# EAGLE design relocker_schematic_cleaned (EAGLE 9.1.3)
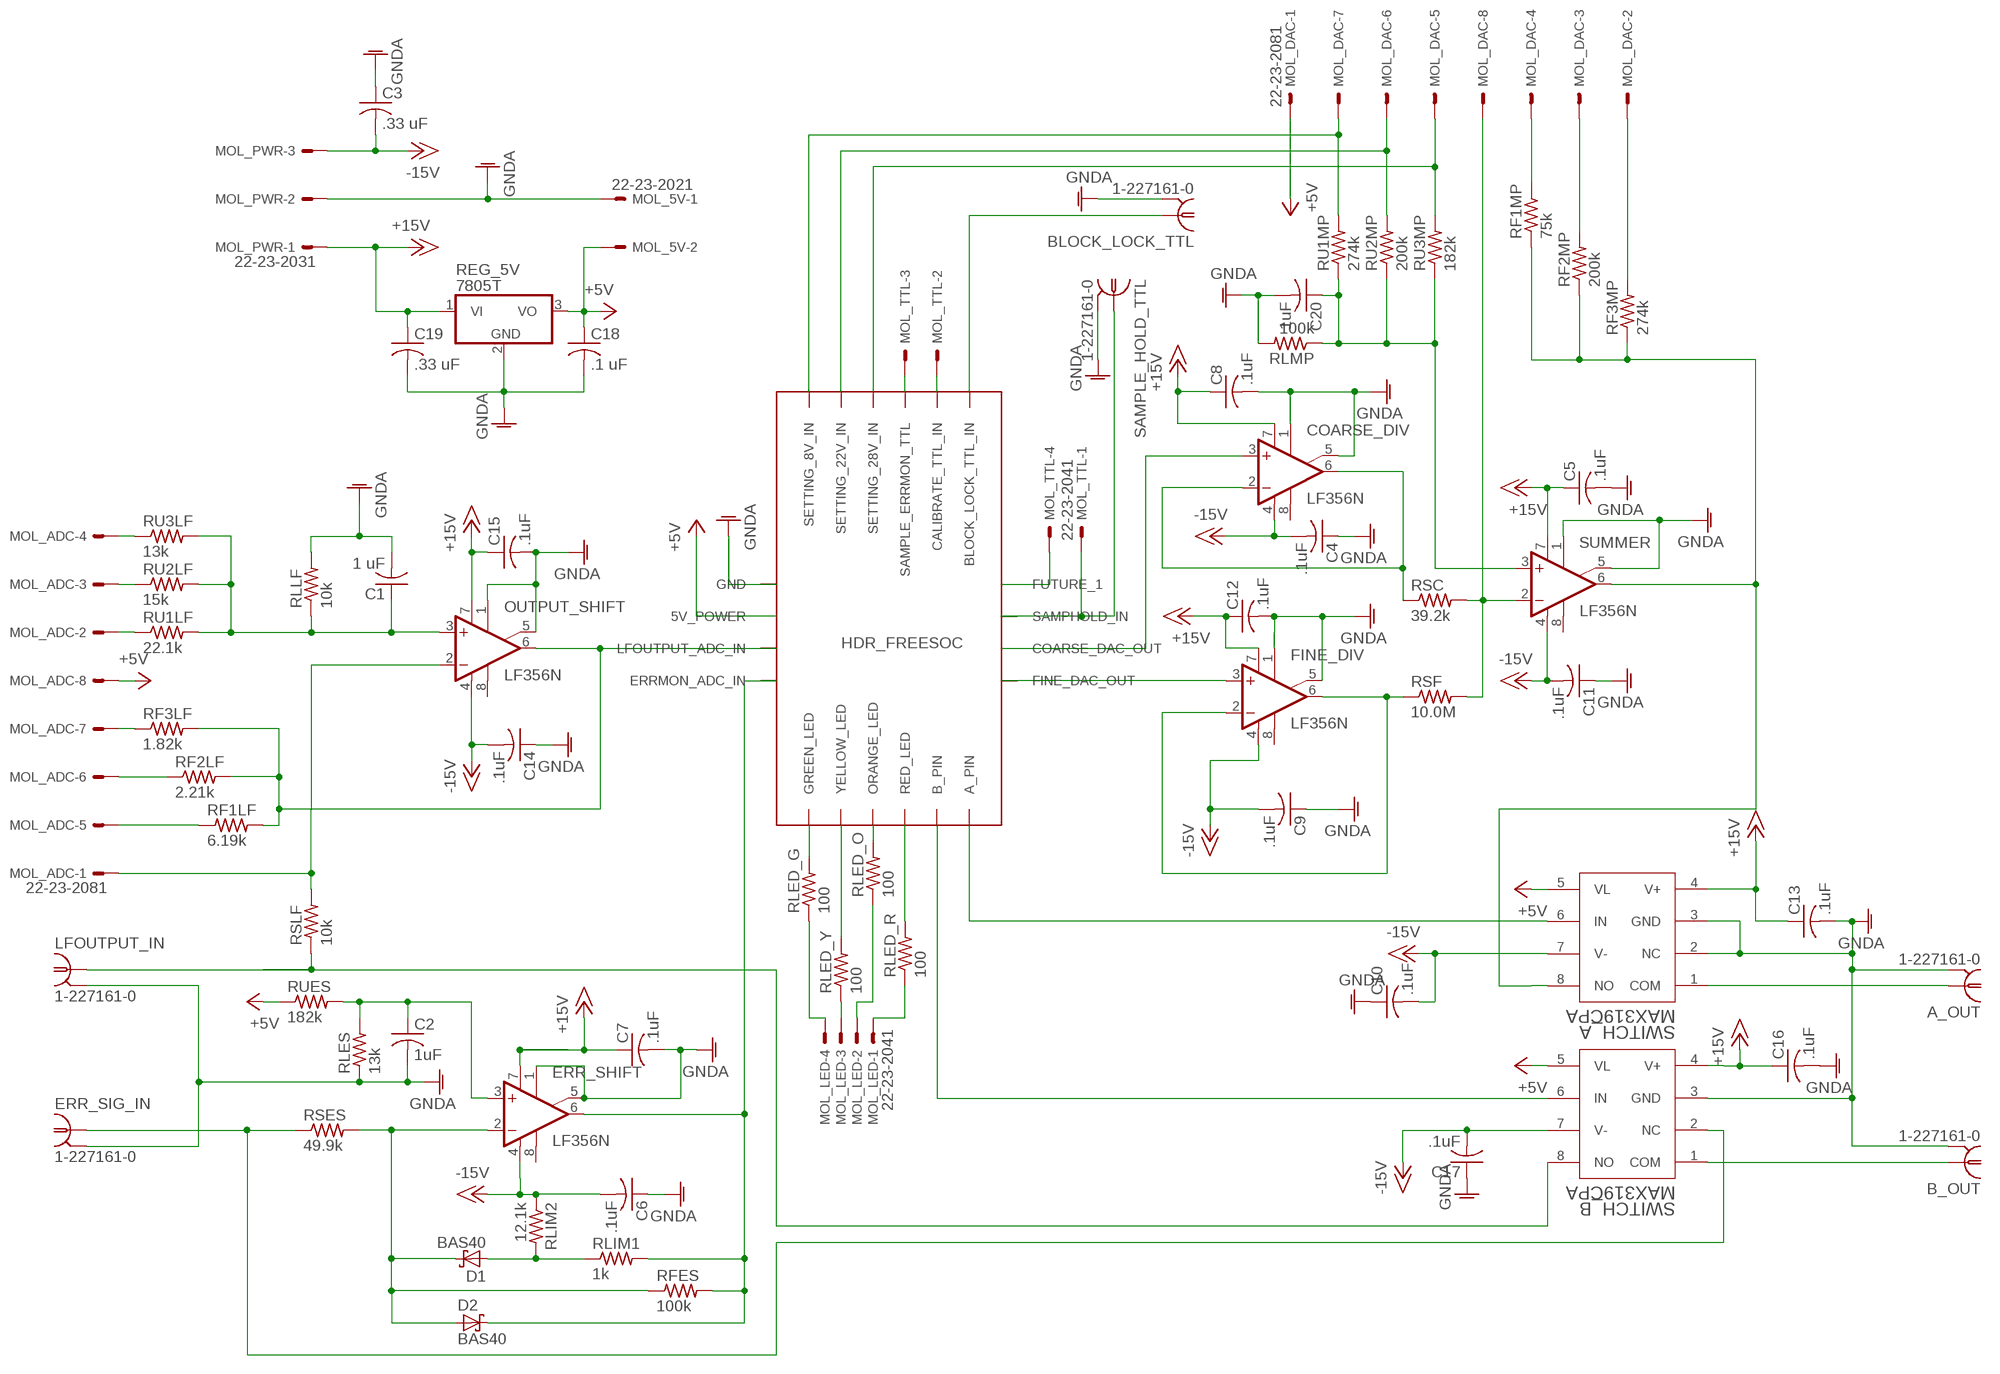
[diagram p0: schematic, sheet 1]

## Parts
A_OUT  1-227161-0  [AMP_227161]
B_OUT  1-227161-0  [AMP_227161]
BLOCK_LOCK_TTL  1-227161-0  [AMP_227161]
C1  1 uF  C-USC0805  [C0805]
C2  1uF  C-USC0805  [C0805]
C3  .33 uF  C-USC0805  [C0805]
C4  .1uF  C-USC0805  [C0805]
C5  .1uF  C-USC0805  [C0805]
C6  .1uF  C-USC0805  [C0805]
C7  .1uF  C-USC0805  [C0805]
C8  .1uF  C-USC0805  [C0805]
C9  .1uF  C-USC0805  [C0805]
C10  .1uF  C-USC0805  [C0805]
C11  .1uF  C-USC0805  [C0805]
C12  .1uF  C-USC0805  [C0805]
C13  .1uF  C-USC0805  [C0805]
C14  .1uF  C-USC0805  [C0805]
C15  .1uF  C-USC0805  [C0805]
C16  .1uF  C-USC0805  [C0805]
C17  .1uF  C-USC0805  [C0805]
C18  .1 uF  C-USC0805  [C0805]
C19  .33 uF  C-USC0805  [C0805]
C20  1uF  C-USC0805  [C0805]
COARSE_DIV  LF356N  [DIL08]
D1  BAS40  [SOT23]
D2  BAS40  [SOT23]
ERR_SHIFT  LF356N  [DIL08]
ERR_SIG_IN  1-227161-0  [AMP_227161]
FINE_DIV  LF356N  [DIL08]
HDR_FREESOC  FREESOC2_BREAKOUT  [FREESOC2_BREAKOUT]
LFOUTPUT_IN  1-227161-0  [AMP_227161]
MOL_5V  22-23-2021  [22-23-2021]
MOL_ADC  22-23-2081  [22-23-2081]
MOL_DAC  22-23-2081  [22-23-2081]
MOL_LED  22-23-2041  [22-23-2041]
MOL_PWR  22-23-2031  [22-23-2031]
MOL_TTL  22-23-2041  [22-23-2041]
OUTPUT_SHIFT  LF356N  [DIL08]
REG_5V  7805T  [TO220H]
RF1LF  6.19k  R-US_R0805  [R0805]
RF1MP  75k  R-US_R0805  [R0805]
RF2LF  2.21k  R-US_R0805  [R0805]
RF2MP  200k  R-US_R0805  [R0805]
RF3LF  1.82k  R-US_R0805  [R0805]
RF3MP  274k  R-US_R0805  [R0805]
RFES  100k  R-US_R0805  [R0805]
RLED_G  100  R-US_R0805  [R0805]
RLED_O  100  R-US_R0805  [R0805]
RLED_R  100  R-US_R0805  [R0805]
RLED_Y  100  R-US_R0805  [R0805]
RLES  13k  R-US_R0805  [R0805]
RLIM1  1k  R-US_R0805  [R0805]
RLIM2  12.1k  R-US_R0805  [R0805]
RLLF  10k  R-US_R0805  [R0805]
RLMP  100k  R-US_R0805  [R0805]
RSC  39.2k  R-US_R0805  [R0805]
RSES  49.9k  R-US_R0805  [R0805]
RSF  10.0M  R-US_R0805  [R0805]
RSLF  10k  R-US_R0805  [R0805]
RU1LF  22.1k  R-US_R0805  [R0805]
RU1MP  274k  R-US_R0805  [R0805]
RU2LF  15k  R-US_R0805  [R0805]
RU2MP  200k  R-US_R0805  [R0805]
RU3LF  13k  R-US_R0805  [R0805]
RU3MP  182k  R-US_R0805  [R0805]
RUES  182k  R-US_R0805  [R0805]
SAMPLE_HOLD_TTL  1-227161-0  [AMP_227161]
SUMMER  LF356N  [DIL08]
SWITCH_A  MAX319CPA  [21-0043D_8]
SWITCH_B  MAX319CPA  [21-0043D_8]

## Nets
+5V: C18.1 HDR_FREESOC.1(5V_POWER) MOL_5V.2 MOL_ADC.8 MOL_DAC.1 REG_5V.3(VO) RUES.1 SWITCH_A.5(VL) SWITCH_B.5(VL)
+15V: C5.1 C7.1 C8.1 C12.1 C13.1 C15.1 C16.1 C19.1 COARSE_DIV.7(V+) ERR_SHIFT.7(V+) FINE_DIV.7(V+) MOL_PWR.1 OUTPUT_SHIFT.7(V+) REG_5V.1(VI) SUMMER.7(V+) SWITCH_A.4(V+) SWITCH_B.4(V+)
-15V: C3.2 C4.2 C6.2 C9.2 C10.2 C11.2 C14.2 C17.2 COARSE_DIV.4(V-) ERR_SHIFT.4(V-) FINE_DIV.4(V-) MOL_PWR.3 OUTPUT_SHIFT.4(V-) RLIM2.1 SUMMER.4(V-) SWITCH_A.7(V-) SWITCH_B.7(V-)
GNDA: A_OUT.2 B_OUT.2 BLOCK_LOCK_TTL.2 C1.2 C2.2 C3.1 C4.1 C5.2 C6.1 C7.2 C8.2 C9.1 C10.1 C11.1 C12.2 C13.2 C14.1 C15.2 C16.2 C17.1 C18.2 C19.2 C20.2 COARSE_DIV.1(ON1) COARSE_DIV.5(ON2) ERR_SHIFT.1(ON1) ERR_SHIFT.5(ON2) ERR_SIG_IN.2 FINE_DIV.1(ON1) FINE_DIV.5(ON2) HDR_FREESOC.2(GND) LFOUTPUT_IN.2 MOL_5V.1 MOL_PWR.2 OUTPUT_SHIFT.1(ON1) OUTPUT_SHIFT.5(ON2) REG_5V.2(GND) RLES.1 RLLF.2 RLMP.2 SAMPLE_HOLD_TTL.2 SUMMER.1(ON1) SUMMER.5(ON2) SWITCH_A.2(NC) SWITCH_A.3(GND) SWITCH_B.3(GND)
N$1: COARSE_DIV.3(+IN) HDR_FREESOC.10(COARSE_DAC_OUT)
N$2: COARSE_DIV.2(-IN) COARSE_DIV.6(OUT) RSC.1
N$3: MOL_DAC.4 RF1MP.2
N$4: FINE_DIV.3(+IN) HDR_FREESOC.11(FINE_DAC_OUT)
N$5: BLOCK_LOCK_TTL.1 HDR_FREESOC.12(BLOCK_LOCK_TTL_IN)
N$6: HDR_FREESOC.17(RED_LED) RLED_R.2
N$7: HDR_FREESOC.18(ORANGE_LED) RLED_O.2
N$8: HDR_FREESOC.19(YELLOW_LED) RLED_Y.2
N$9: HDR_FREESOC.20(GREEN_LED) RLED_G.2
N$10: MOL_LED.4 RLED_G.1
N$11: MOL_LED.3 RLED_Y.1
N$12: MOL_LED.2 RLED_O.1
N$13: MOL_LED.1 RLED_R.1
N$14: A_OUT.1 SWITCH_A.1(COM)
N$15: RF1MP.1 RF2MP.1 RF3MP.1 SUMMER.6(OUT) SWITCH_A.8(NO)
N$16: HDR_FREESOC.6(A_PIN) SWITCH_A.6(IN)
N$17: B_OUT.1 SWITCH_B.1(COM)
N$18: ERR_SIG_IN.1 RSES.1 SWITCH_B.2(NC)
N$19: HDR_FREESOC.9(SETTING_8V_IN) MOL_DAC.7 RU1MP.2
N$20: HDR_FREESOC.5(B_PIN) SWITCH_B.6(IN)
N$21: LFOUTPUT_IN.1 RSLF.1 SWITCH_B.8(NO)
N$22: HDR_FREESOC.8(SETTING_22V_IN) MOL_DAC.6 RU2MP.2
N$23: HDR_FREESOC.7(SETTING_28V_IN) MOL_DAC.5 RU3MP.2
N$24: MOL_ADC.1 OUTPUT_SHIFT.2(-IN) RSLF.2
N$25: MOL_DAC.8 RSC.2 RSF.2 SUMMER.2(-IN)
N$26: FINE_DIV.2(-IN) FINE_DIV.6(OUT) RSF.1
N$27: MOL_DAC.3 RF2MP.2
N$28: MOL_DAC.2 RF3MP.2
N$29: C20.1 RLMP.1 RU1MP.1 RU2MP.1 RU3MP.1 SUMMER.3(+IN)
N$30: HDR_FREESOC.3(LFOUTPUT_ADC_IN) OUTPUT_SHIFT.6(OUT) RF1LF.2 RF2LF.2 RF3LF.2
N$31: MOL_ADC.5 RF1LF.1
N$32: MOL_ADC.6 RF2LF.1
N$33: MOL_ADC.7 RF3LF.1
N$34: MOL_ADC.2 RU1LF.1
N$35: MOL_ADC.3 RU2LF.1
N$36: MOL_ADC.4 RU3LF.1
N$37: C1.1 OUTPUT_SHIFT.3(+IN) RLLF.1 RU1LF.2 RU2LF.2 RU3LF.2
N$38: D1.3(C) D2.1(A) ERR_SHIFT.2(-IN) RFES.1 RSES.2
N$39: C2.1 ERR_SHIFT.3(+IN) RLES.2 RUES.2
N$40: D2.3(C) ERR_SHIFT.6(OUT) HDR_FREESOC.4(ERRMON_ADC_IN) RFES.2 RLIM1.2
N$41: HDR_FREESOC.16(FUTURE_1) MOL_TTL.4
N$42: HDR_FREESOC.13(SAMPHOLD_IN) MOL_TTL.1 SAMPLE_HOLD_TTL.1
N$43: HDR_FREESOC.14(CALIBRATE_TTL_IN) MOL_TTL.2
N$44: HDR_FREESOC.15(SAMPLE_ERRMON_TTL) MOL_TTL.3
N$46: D1.1(A) RLIM1.1 RLIM2.2
Unconnected: COARSE_DIV.8(OPT) ERR_SHIFT.8(OPT) FINE_DIV.8(OPT) OUTPUT_SHIFT.8(OPT) SUMMER.8(OPT)

## Library data of the parts
A_OUT B_OUT BLOCK_LOCK_TTL ERR_SIG_IN LFOUTPUT_IN SAMPLE_HOLD_TTL = con-coax:?227161*: JACK, RIGHT ANGLE, 50 OHM, PCB, BNC Source: amp_227161.pdf; MF: TYCO ELECTRONICS; MPN: 1-227161; OC_FARNELL: unknown; OC_NEWARK: 33B3200
C1-C20 = rcl:C-US: CAPACITOR, American symbol; SPICEPREFIX: C
COARSE_DIV ERR_SHIFT FINE_DIV OUTPUT_SHIFT SUMMER = linear:LF356: OP AMP
D1 D2 = diode:BAS40: Silicon Schottky Diodes General-purpose diode for high-speed switching
HDR_FREESOC = custom_parts_library:FREESOC2_BREAKOUT: Breakout FreeSoc2 Pins For the relocker project
MOL_5V = con-molex:22-23-2021: .100" (2.54mm) Center Header - 2 Pin; MF: MOLEX; MPN: 22-23-2021; OC_FARNELL: 1462926; OC_NEWARK: 25C3832
MOL_ADC MOL_DAC = con-molex:22-23-2081: .100" (2.54mm) Center Header - 8 Pin; MF: MOLEX; MPN: 22-23-2081; OC_FARNELL: 1756826; OC_NEWARK: 01C7592
MOL_LED MOL_TTL = con-molex:22-23-2041: .100" (2.54mm) Center Header - 4 Pin; MF: MOLEX; MPN: 22-23-2041; OC_FARNELL: 1462920; OC_NEWARK: 38C0355
MOL_PWR = con-molex:22-23-2031: .100" (2.54mm) Center Header - 3 Pin; MF: MOLEX; MPN: 22-23-2031; OC_FARNELL: 1462950; OC_NEWARK: 30C0862
REG_5V = linear:78*: Positive VOLTAGE REGULATOR Source: http://cache.national.com/ds/LM/LM78L05.pdf http://www.fairchildsemi.com/ds/LM/LM7805.pdf
RF1LF RF1MP RF2LF RF2MP RF3LF RF3MP RFES RLED_G RLED_O RLED_R RLED_Y RLES RLIM1 RLIM2 RLLF RLMP RSC RSES RSF RSLF RU1LF RU1MP RU2LF RU2MP RU3LF RU3MP RUES = rcl:R-US_: RESISTOR, American symbol; SPICEPREFIX: R
SWITCH_A SWITCH_B = custom_parts_library:MAX319CPA: Maxim MAX319CPA This switch was imported with Ultra Librarian and then the schematic was edited, but the footprint looks good, I hope.; MANUFACTURER_PART_NUMBER: MAX319CPA; VENDOR: Maxim

## Board
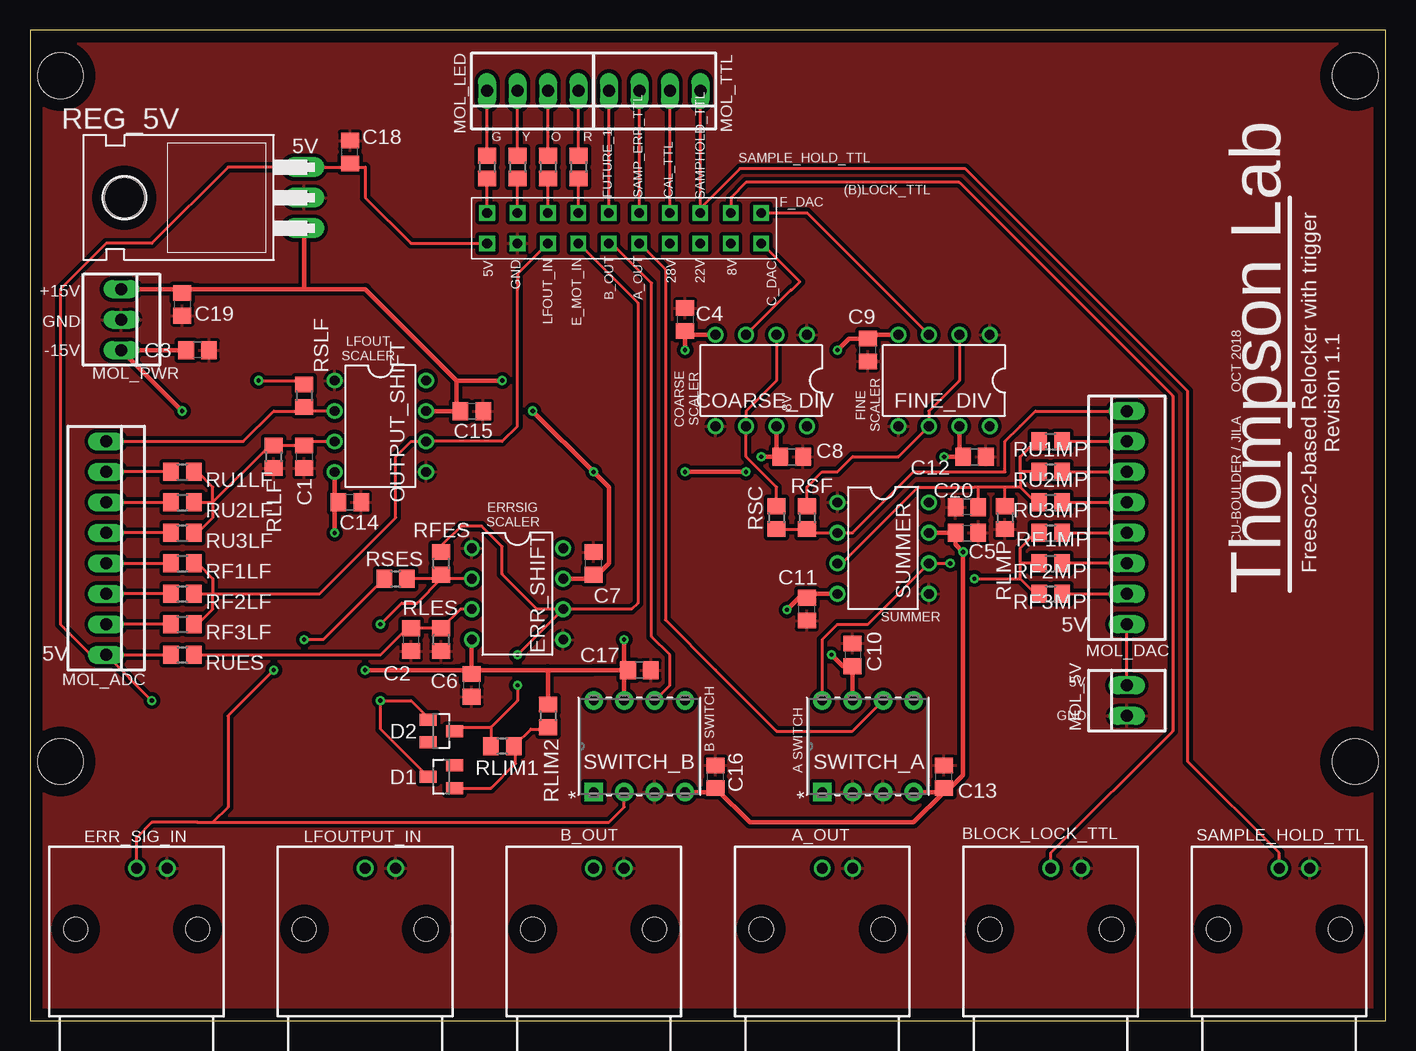
[diagram p1: board, top side]
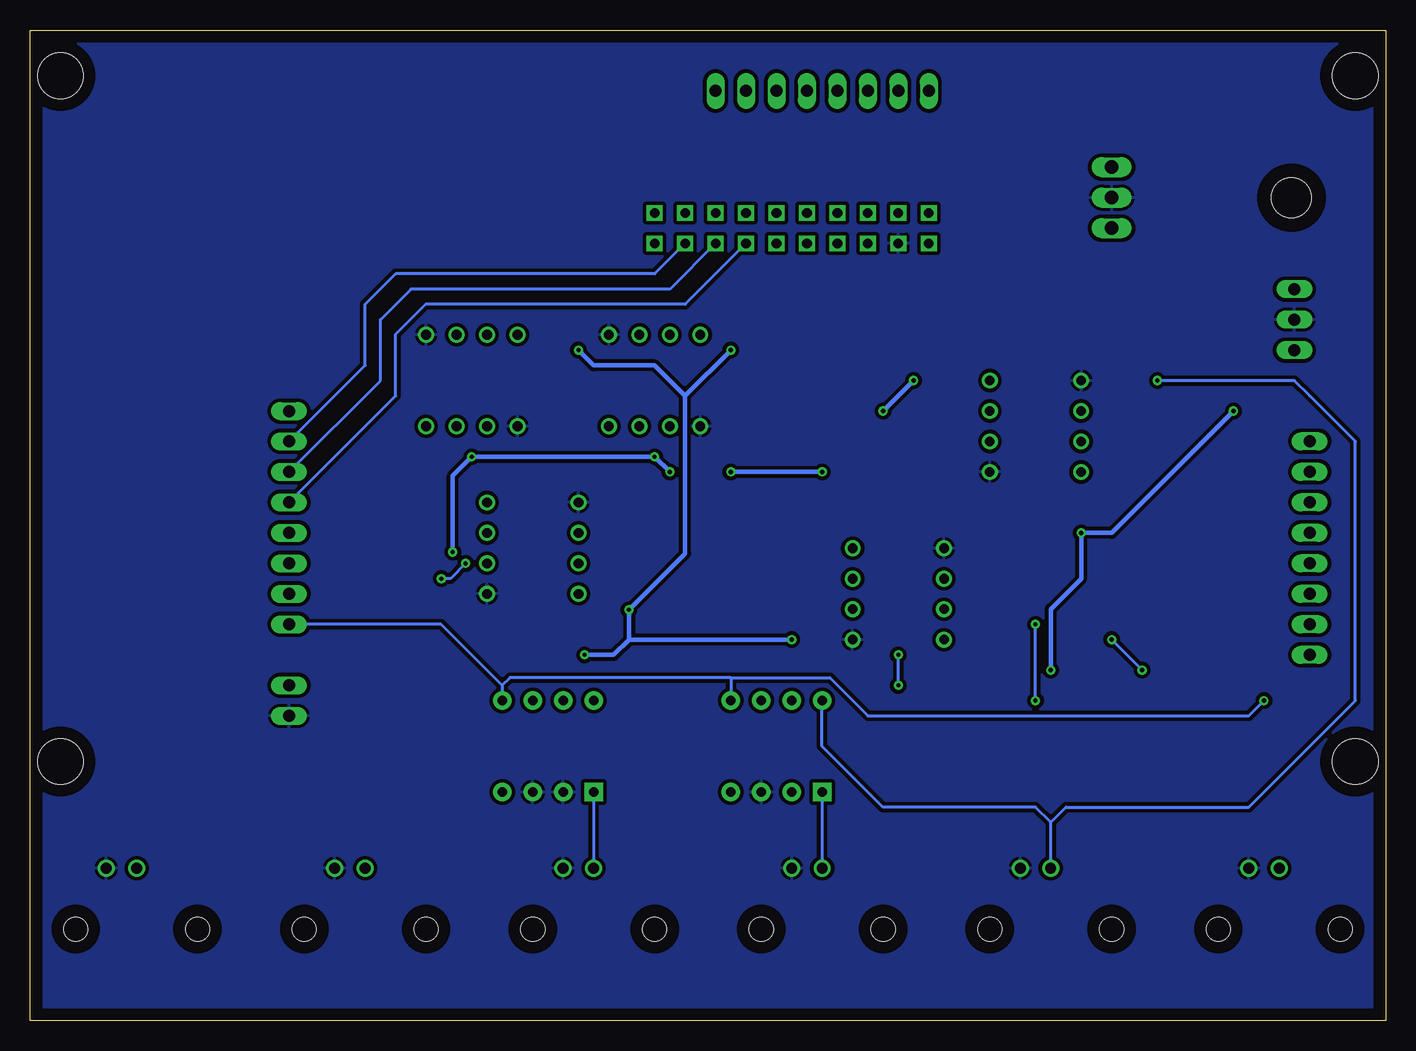
[diagram p2: board, bottom side, seen from below]

Size 113.03 x 82.55 mm. Coordinates in mm from the lower left corner, seen from the top.
Outline: 0,0 113.03,0 113.03,82.55 0,82.55 0,0
Copper layers (1*16): Top 0.035mm / dielectric 1.5mm / Bottom 0.035mm
Design rules "default": minimum track width 6mil, minimum drill 0.35mm, track to track 6mil, track to pad 6mil, pad to pad 6mil, via to via 6mil, smd to smd 6mil, copper to edge 40mil, drill to drill 6mil, minimum pad ring 10mil, minimum via ring 8mil, stop-mask expansion 4mil, vias tented up to drill 0mil, thermal gap 10mil
Holes 3.8 mm at 2.54,78.74 110.49,78.74 110.49,21.59 2.54,21.59

### Footprints (pad centres in the part's own frame; a part is rotated, then mirrored left to right if it is on the bottom)
AMP_227161 = drill 0.9 pad 1.27: 1 0,-5.08; 2 -2.54,-5.08 | hole 2: -5.08,0; 5.08,0
C0805 = smd 1.3 x 1.5: 1 -0.95,0; 2 0.95,0
DIL08 = drill 0.813 pad 1.27: 1 -3.81,-3.81; 2 -1.27,-3.81; 3 1.27,-3.81; 4 3.81,-3.81; 5 3.81,3.81; 6 1.27,3.81; 7 -1.27,3.81; 8 -3.81,3.81
SOT23 = smd 1 x 1.4: 1 -0.95,-1.1; 2 0.95,-1.1; 3 0,1.1
FREESOC2_BREAKOUT = drill 0.8 square: 1 1.27,-1.27; 2 1.27,-3.81; 3 1.27,-6.35; 4 1.27,-8.89; 5 1.27,-11.43; 6 1.27,-13.97; 7 1.27,-16.51; 8 1.27,-19.05; 9 1.27,-21.59; 10 1.27,-24.13; 11 3.81,-24.13; 12 3.81,-21.59; 13 3.81,-19.05; 14 3.81,-16.51; 15 3.81,-13.97; 16 3.81,-11.43; 17 3.81,-8.89; 18 3.81,-6.35; 19 3.81,-3.81; 20 3.81,-1.27
22-23-2021 = drill 1 long: 1 -1.27,0; 2 1.27,0
22-23-2081 = drill 1 long: 1 -8.89,0; 2 -6.35,0; 3 -3.81,0; 4 -1.27,0; 5 1.27,0; 6 3.81,0; 7 6.35,0; 8 8.89,0
22-23-2041 = drill 1 long: 1 -3.81,0; 2 -1.27,0; 3 1.27,0; 4 3.81,0
22-23-2031 = drill 1 long: 1 -2.54,0; 2 0,0; 3 2.54,0
TO220H = drill 1.118 long: 1 -2.54,-10.16; 2 0,-10.16; 3 2.54,-10.16 | hole 3.302: 0,4.826
R0805 = smd 1.3 x 1.5: 1 -0.95,0; 2 0.95,0
21-0043D_8 = drill 0.813 pad 1.524 square: 1 -7.62,7.62 | drill 0.813 pad 1.524: 2 -7.62,5.08; 3 -7.62,2.54; 4 -7.62,0; 5 0,0; 6 0,2.54; 7 0,5.08; 8 0,7.62

### Placement (x,y rotation side)
A_OUT  66.04,7.62 180 top
B_OUT  46.99,7.62 180 top
BLOCK_LOCK_TTL  85.09,7.62 180 top
C1  22.86,46.99 270 top
C2  31.75,31.75 270 top
C3  13.97,55.88 180 top
C4  54.61,58.42 270 top
C5  78.11,40.64 0 top
C6  36.83,27.94 90 top
C7  46.99,38.1 90 top
C8  63.5,46.99 0 top
C9  69.85,55.88 90 top
C10  68.58,30.48 270 top
C11  64.77,34.29 90 top
C12  78.74,46.99 0 top
C13  76.2,20.32 90 top
C14  26.67,43.18 180 top
C15  36.83,50.8 0 top
C16  57.15,20.32 90 top
C17  50.8,29.21 180 top
C18  26.67,72.39 90 top
C19  12.7,59.69 270 top
C20  78.11,42.8 180 top
COARSE_DIV  60.96,53.34 180 top
D1  34.29,20.32 90 top
D2  34.29,24.13 270 top
ERR_SHIFT  40.64,35.56 270 top
ERR_SIG_IN  8.89,7.62 180 top
FINE_DIV  76.2,53.34 180 top
HDR_FREESOC  36.83,63.5 90 top
LFOUTPUT_IN  27.94,7.62 180 top
MOL_5V  91.44,26.67 90 top
MOL_ADC  6.35,39.37 270 top
MOL_DAC  91.44,41.91 90 top
MOL_LED  41.91,77.47 180 top
MOL_PWR  7.62,58.42 270 top
MOL_TTL  52.07,77.47 180 top
OUTPUT_SHIFT  29.21,49.53 270 top
REG_5V  12.7,68.58 90 top
RF1LF  12.7,38.1 0 top
RF1MP  85.09,40.64 0 top
RF2LF  12.7,35.56 0 top
RF2MP  85.09,38.1 0 top
RF3LF  12.7,33.02 0 top
RF3MP  85.09,35.56 0 top
RFES  34.29,38.1 90 top
RLED_G  38.1,71.12 270 top
RLED_O  43.18,71.12 270 top
RLED_R  45.72,71.12 270 top
RLED_Y  40.64,71.12 270 top
RLES  34.29,31.75 90 top
RLIM1  39.37,22.86 180 top
RLIM2  43.18,25.4 270 top
RLLF  20.32,46.99 270 top
RLMP  81.28,41.91 270 top
RSC  62.23,41.91 270 top
RSES  30.48,36.83 0 top
RSF  64.77,41.91 270 top
RSLF  22.86,52.07 270 top
RU1LF  12.7,45.72 0 top
RU1MP  85.09,48.26 0 top
RU2LF  12.7,43.18 0 top
RU2MP  85.09,45.72 0 top
RU3LF  12.7,40.64 0 top
RU3MP  85.09,43.18 0 top
RUES  12.7,30.48 0 top
SAMPLE_HOLD_TTL  104.14,7.62 180 top
SUMMER  71.12,39.37 270 top
SWITCH_A  73.66,26.67 90 top
SWITCH_B  54.61,26.67 90 top

### Tracks (layer width: path | path; a pad name or v marks a point on that pad's centre or on a via)
+5V  (via drill 0.35)
  Top 0.152: C18.1 26.99,71.12 27.94,71.12
  Top 0.254: MOL_ADC.8 5.08,30.48 2.54,33.02 2.54,60.96 6.35,64.77 10.16,64.77 16.51,71.12 REG_5V.3 27.94,71.12 27.94,68.58 31.75,64.77 HDR_FREESOC.1 | MOL_ADC.8 RUES.1 | v10.16,26.67 MOL_ADC.8 | MOL_5V.2 MOL_DAC.1
  Bottom 0.254: 54.61,28.57 73.03,28.57 73.66,27.94 | 54.61,28.57 46.35,28.57 43.18,25.4 11.43,25.4 v10.16,26.67 | 73.66,27.94 78.74,33.02 MOL_DAC.1 | 54.61,28.57 SWITCH_B.5 | 73.66,27.94 SWITCH_A.5
+15V  (via drill 0.35)
  Top 0.152: C19.1 13.02,60.96 13.97,60.96
  Top 0.254: C16.1 57.15,19.05 | 76.2,19.05 C13.1 76.71,19.37 | C15.1 35.56,51.12 | C12.1 77.47,46.99 | 62.23,46.99 C8.1 | 46.67,36.83 C7.1 47.31,37.15
  Top 0.381: 22.86,60.96 27.94,60.96 35.56,53.34 | OUTPUT_SHIFT.7 C15.1 | SWITCH_A.4 76.2,19.05 73.66,16.51 60.01,16.51 C16.1 | SWITCH_B.4 57.15,19.05 | 35.56,51.12 35.56,53.34 | v39.37,53.34 35.56,53.34 | v76.2,46.99 77.47,46.99 FINE_DIV.7 | v60.96,46.99 62.23,46.99 COARSE_DIV.7 | v59.69,45.72 v54.61,45.72 | SUMMER.7 C5.1 77.16,39.69 v77.79,39.05 77.79,36.83 77.79,35.56 77.79,20.45 77.56,20.23 76.71,19.37 | MOL_PWR.1 12.7,60.96 13.97,60.96 22.86,60.96 | v41.91,50.8 v46.99,45.72 48.26,44.45 48.26,38.1 47.31,37.15 | REG_5V.1 22.86,60.96 | ERR_SHIFT.7 46.67,36.83
  Bottom 0.381: v41.91,50.8 v39.37,53.34 | v59.69,45.72 v60.96,46.99 v76.2,46.99 77.79,45.4 v77.79,39.05 | v54.61,45.72 v46.99,45.72
-15V  (via drill 0.35)
  Top 0.381: v67.31,55.88 68.26,56.83 C9.2 70.17,57.15 FINE_DIV.4 | v66.8,30.48 67.75,29.53 C10.2 SWITCH_A.7 | v63.11,34.23 64.11,35.24 C11.2 65.09,35.56 SUMMER.4 | v12.7,50.8 MOL_PWR.3 C3.2 | 36.83,29.21 ERR_SHIFT.4 | 43.18,29.21 38.1,29.21 36.83,29.21 | 43.18,29.21 46.99,29.21 C17.2 | v49.53,31.75 49.53,29.53 C17.2 | v27.94,29.21 34.29,29.21 35.56,29.21 36.83,29.21 | RLIM2.1 43.18,29.21 | OUTPUT_SHIFT.4 25.4,43.5 C14.2 25.4,42.86 v25.4,40.64 | C6.2 36.83,29.21 | C17.2 49.53,28.89 SWITCH_B.7 | COARSE_DIV.4 54.93,57.15 C4.2 v54.61,55.88
  Bottom 0.381: 58.42,52.07 58.42,38.92 v63.11,34.23 63.11,31.75 | v12.7,50.8 22.86,40.64 v25.4,40.64 25.4,36.83 27.94,34.29 v27.94,29.21 | v49.53,31.75 63.11,31.75 | 63.11,31.75 64.38,30.48 v66.8,30.48 | v67.31,55.88 66.04,54.61 60.96,54.61 58.42,52.07 | v54.61,55.88 58.42,52.07
GNDA
  pour Bottom (isolate 0.305): 0,82.55 119.38,82.55 119.38,0 0,0
  pour Top (isolate 0.305): 0,82.55 119.38,82.55 119.38,0 0,0
N$1
  Top 0.254: HDR_FREESOC.10 64.17,61.56 63.44,60.83 63.44,60.9 COARSE_DIV.3
N$2
  Top 0.254: RSC.1 62.23,44.45 59.69,46.99 COARSE_DIV.6 59.69,50.8 62.23,53.34 COARSE_DIV.2
N$3
  Top 0.254: RF1MP.2 MOL_DAC.4
N$4
  Top 0.254: HDR_FREESOC.11 64.77,67.31 FINE_DIV.3
N$5
  Top 0.254: HDR_FREESOC.12 58.42,68.58 59.69,69.85 77.47,69.85 95.25,52.07 95.25,24.13 85.09,13.97 BLOCK_LOCK_TTL.1
N$6
  Top 0.254: HDR_FREESOC.17 RLED_R.2
N$7
  Top 0.254: HDR_FREESOC.18 RLED_O.2
N$8
  Top 0.254: HDR_FREESOC.19 RLED_Y.2
N$9
  Top 0.254: HDR_FREESOC.20 RLED_G.2
N$10
  Top 0.254: RLED_G.1 MOL_LED.4
N$11
  Top 0.254: RLED_Y.1 MOL_LED.3
N$12
  Top 0.254: RLED_O.1 MOL_LED.2
N$13
  Top 0.254: RLED_R.1 MOL_LED.1
N$14
  Bottom 0.254: SWITCH_A.1 A_OUT.1
N$15  (via drill 0.35)
  Top 0.254: 82.55,36.83 83.82,35.56 RF3MP.1 | RF1MP.1 83.82,40.64 82.55,39.37 82.55,38.1 | 82.55,36.83 82.55,38.1 | RF2MP.1 82.55,38.1 | v76.71,38.1 SUMMER.6 72.39,35.56 69.85,33.02 67.31,33.02 66.04,31.75 SWITCH_A.8 | v78.74,36.83 82.55,36.83
  Bottom 0.254: v78.74,36.83 77.98,36.83 v76.71,38.1
N$16
  Top 0.254: HDR_FREESOC.6 52.96,62.61 52.96,33.4 57.15,29.21 62.23,24.13 68.58,24.13 SWITCH_A.6
N$17
  Bottom 0.254: SWITCH_B.1 B_OUT.1
N$18  (via drill 0.35)
  Top 0.254: ERR_SIG_IN.1 8.89,15.24 10.16,16.51 13.97,16.51 15.24,16.51 | v20.32,29.21 16.51,25.4 16.51,17.78 15.24,16.51 | v22.86,31.75 24.45,31.75 RSES.1 | 15.24,16.51 48.26,16.51 49.53,17.78 SWITCH_B.2
  Bottom 0.254: v22.86,31.75 v20.32,29.21
N$19
  Top 0.254: RU1MP.2 MOL_DAC.7
  Bottom 0.254: HDR_FREESOC.9 60.96,62.23 82.55,62.23 85.09,59.69 85.09,54.61 MOL_DAC.7
N$20
  Top 0.254: HDR_FREESOC.5 48.26,65 51.82,61.45 51.82,32 53.34,30.48 53.34,27.94 SWITCH_B.6
N$21  (via drill 0.35)
  Top 0.254: RSLF.1 22.54,53.34 v19.05,53.34
  Bottom 0.254: v19.05,53.34 7.62,53.34 6.35,52.07 2.54,48.26 2.54,26.67 11.43,17.78 26.67,17.78 27.94,16.51 | LFOUTPUT_IN.1 27.94,16.51 | 27.94,16.51 29.21,17.78 41.91,17.78 46.99,22.86 SWITCH_B.8
N$22
  Top 0.254: RU2MP.2 MOL_DAC.6
  Bottom 0.254: HDR_FREESOC.8 59.69,60.96 81.28,60.96 83.82,58.42 83.82,53.34 MOL_DAC.6
N$23
  Top 0.254: RU3MP.2 MOL_DAC.5
  Bottom 0.254: HDR_FREESOC.7 58.42,59.69 80.07,59.69 82.55,57.21 82.55,52.07 MOL_DAC.5
N$24
  Top 0.254: 22.86,50.8 20.32,50.8 17.78,48.26 MOL_ADC.1 | 22.86,50.8 RSLF.2 | OUTPUT_SHIFT.2 22.86,50.8
N$25
  Top 0.254: RSC.2 RSF.2 65.09,40.64 SUMMER.2 68.58,40.64 73.66,45.72 81.28,45.72 81.28,48.26 82.55,49.53 83.82,50.8 MOL_DAC.8
N$26
  Top 0.254: RSF.1 64.77,44.45 66.04,45.72 67.31,45.72 68.58,46.99 72.39,46.99 FINE_DIV.6 74.93,50.8 77.47,53.34 FINE_DIV.2
N$27
  Top 0.254: MOL_DAC.3 RF2MP.2
N$28
  Top 0.254: RF3MP.2 MOL_DAC.2
N$29
  Top 0.254: RU3MP.1 83.82,43.18 82.55,44.45 | RU1MP.1 83.82,48.26 82.55,46.99 82.55,45.72 | RU2MP.1 82.55,45.72 | 82.55,45.72 82.55,44.45 | 82.55,44.45 81.28,44.45 | 81.28,44.45 79.12,44.45 | 79.12,44.45 78.74,44.45 74.04,44.45 67.69,38.1 SUMMER.3 | RLMP.1 81.28,44.45 | C20.1 79.06,44.38 79.12,44.45
N$30
  Top 0.254: HDR_FREESOC.3 40.64,62.23 40.64,60.96 40.64,49.53 39.37,48.26 OUTPUT_SHIFT.6 31.75,48.26 30.48,46.99 30.48,41.91 24.13,35.56 15.24,35.56 | RF3LF.2 13.97,33.02 15.24,34.29 15.24,35.56 | RF1LF.2 13.97,38.1 15.24,36.83 15.24,35.56 | RF2LF.2 15.24,35.56
N$31
  Top 0.254: MOL_ADC.5 RF1LF.1
N$32
  Top 0.254: RF2LF.1 MOL_ADC.6
N$33
  Top 0.254: RF3LF.1 MOL_ADC.7
N$34
  Top 0.254: RU1LF.1 MOL_ADC.2
N$35
  Top 0.254: MOL_ADC.3 RU2LF.1
N$36
  Top 0.254: RU3LF.1 MOL_ADC.4
N$37
  Top 0.254: RU1LF.2 13.97,45.72 15.24,44.45 15.24,43.18 | 15.24,43.18 15.24,41.91 13.97,40.64 RU3LF.2 | RU2LF.2 15.24,43.18 | 15.24,43.18 20,47.94 RLLF.1 C1.1 23.18,48.26 OUTPUT_SHIFT.3
N$38  (via drill 0.35)
  Top 0.254: v29.21,33.02 30.99,34.8 31.75,34.8 32.26,34.8 34.29,36.83 | D2.1 33.19,25.23 31.75,26.67 v29.21,26.67 29.21,24.3 D1.3 | RFES.1 34.13,36.99 | 34.13,36.99 33.97,36.83 RSES.2 | ERR_SHIFT.2 34.29,36.83 | 34.29,36.83 34.13,36.99
  Bottom 0.254: v29.21,26.67 v29.21,33.02
N$39
  Top 0.254: RUES.2 29.21,30.48 31.59,32.86 C2.1 RLES.2 35.88,34.29 ERR_SHIFT.3
N$40  (via drill 0.35)
  Top 0.254: ERR_SHIFT.6 42.29,34.29 39.37,37.21 39.37,39.5 37.66,41.21 35.94,41.21 34.29,39.56 RFES.2 | HDR_FREESOC.4 50.67,59.82 50.67,34.8 50.16,34.29 ERR_SHIFT.6 | v40.64,27.94 40.64,26.67 38.42,24.45 | v40.64,30.48 ERR_SHIFT.6 | 38.42,24.45 RLIM1.2 | D2.3 35.71,24.45 38.42,24.45
  Bottom 0.254: v40.64,27.94 v40.64,30.48
N$41
  Top 0.254: HDR_FREESOC.16 MOL_TTL.4
N$42
  Top 0.254: MOL_TTL.1 HDR_FREESOC.13 55.88,67.69 59.18,70.99 77.98,70.99 96.52,52.45 96.52,21.59 104.14,13.97 SAMPLE_HOLD_TTL.1
N$43
  Top 0.254: HDR_FREESOC.14 MOL_TTL.2
N$44
  Top 0.254: HDR_FREESOC.15 MOL_TTL.3
N$46
  Top 0.254: RLIM2.2 43.34,24.29 41.75,24.29 40.48,23.02 | RLIM1.1 40.48,23.02 | D1.1 38.42,19.37 40.48,21.43 40.48,23.02

### Text on the board
tPlace: G | Y | O | R | 5V | SAMPLE_HOLD_TTL | FUTURE_1 | SAMP_ERR_TTL | CAL_TTL | (B)LOCK_TTL | SAMPHOLD_TTL | F_DAC | 5V | 8V | +15V | GND | 28V | 22V | B_OUT | A_OUT | C_DAC | GND | LFOUT_IN | E_MOT_IN | -15V | LFOUT / SCALER | COARSE / SCALER | Freesoc2-based Relocker with trigger / Revision 1.1 | 8V | FINE / SCALER | ERRSIG / SCALER | CU-BOULDER / JILA OCT 2018 | Thompson Lab | SUMMER | 5V | 5V | 5V | B SWITCH | GND | A SWITCH